# EAGLE design Solar Charge Controller  (EAGLE 7.7.0)
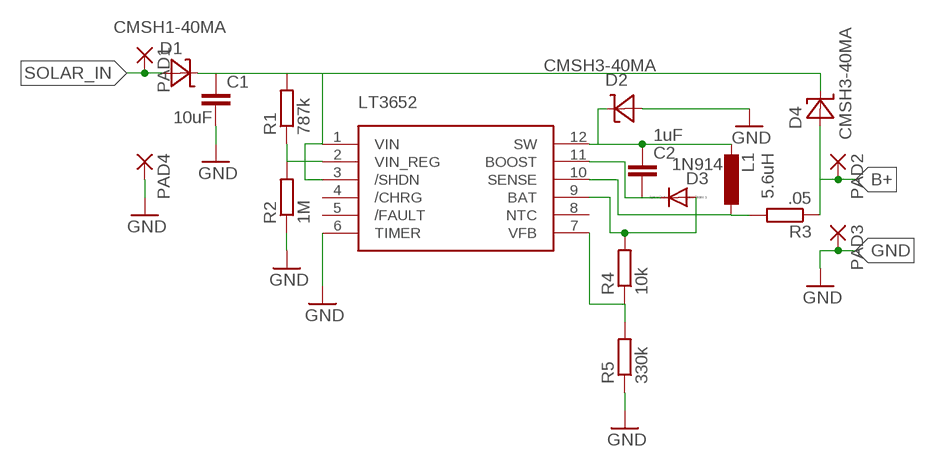
[diagram p0: schematic, sheet 1]

## Parts
C1  10uF  C-EUC0805  [C0805]
C2  1uF  C-EUC0603  [C0603]
D1  CMSH1-40MA  [DO-214AC]
D2  CMSH3-40MA  [DO-214AC]
D3  1N914  [SOD523]
D4  CMSH3-40MA  [DO-214AC]
L1  5.6uH  L-EU1008  [1008(2510METRIC)]
PAD1  SMD5  [SMD2,54-5,08]
PAD2  SMD5  [SMD2,54-5,08]
PAD3  SMD5  [SMD2,54-5,08]
PAD4  SMD5  [SMD2,54-5,08]
R1  787k  R-EU_R0603  [R0603]
R2  1M  R-EU_R0603  [R0603]
R3  .05  R-EU_R0805  [R0805]
R4  10k  R-EU_R0603  [R0603]
R5  330k  R-EU_R0603  [R0603]
U$1  LT3652  [MSOP12]

## Nets
B+: D4.A PAD2.1(P) R3.1
GND: C1.2 D2.A PAD3.1(P) PAD4.1(P) R2.1 R5.1 U$1.6(TIMER)
N$1: C1.1 D1.C D4.C R1.2 U$1.1(VIN) U$1.3(/SHDN)
N$2: R1.1 R2.2 U$1.2(VIN_REG)
N$3: C2.1 D2.C L1.P$3 U$1.12(SW)
N$4: L1.P$2 R3.2 U$1.10(SENSE)
N$5: D3.A R4.2 U$1.9(BAT)
N$6: C2.2 D3.C U$1.11(BOOST)
N$7: R4.1 R5.2 U$1.7(VFB)
SOLAR_IN: D1.A PAD1.1(P)
Unconnected: U$1.4(/CHRG) U$1.5(/FAULT) U$1.8(NTC)

## Library data of the parts
C1 C2 = rcl:C-EU: CAPACITOR, European symbol
D1 = diode:CMSH1-40MA
D2 D4 = diode:CMSH3-40MA
D3 = diode:1N914
L1 = rcl:L-EU: INDUCTOR, European symbol
PAD1-PAD4 = wirepad:SMD5: SMD PAD
R1 R2 R4 R5 = rcl:R-EU_: RESISTOR, European symbol
R3 = resistor:R-EU_: RESISTOR, European symbol
U$1 = linear-technology:LT3652

## Board
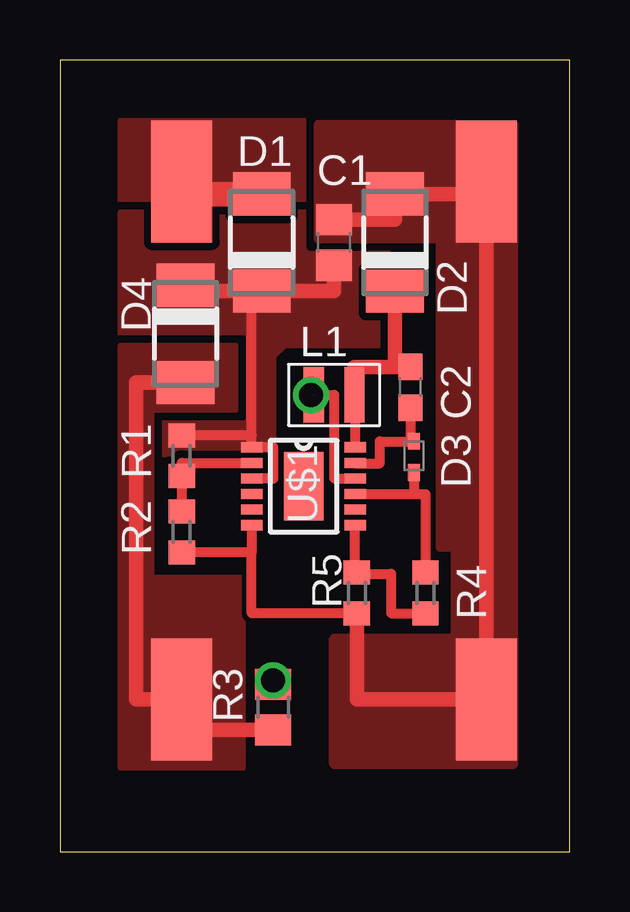
[diagram p1: board, top side]
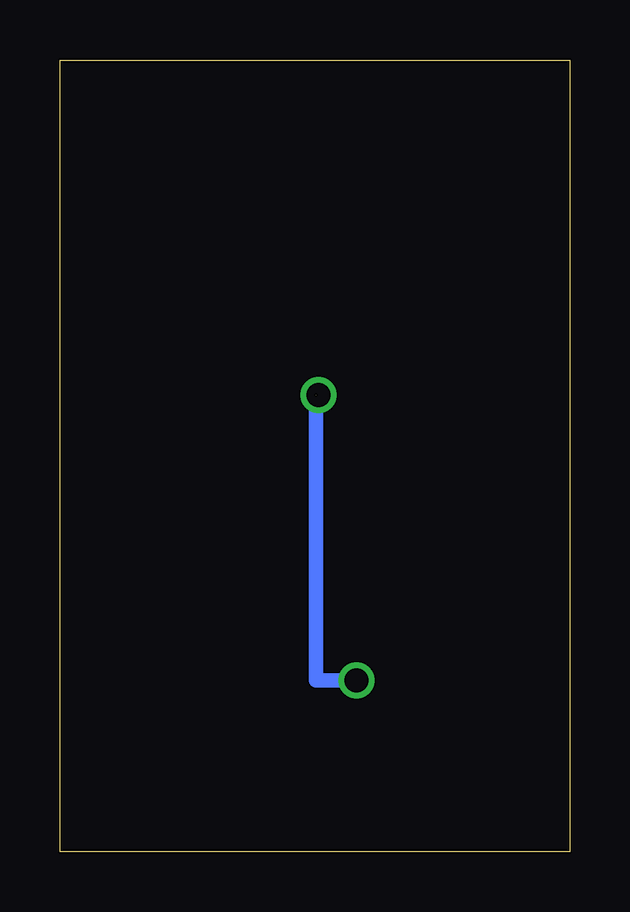
[diagram p2: board, bottom side, seen from below]

Size 21.26 x 33.01 mm. Coordinates in mm from the lower left corner, seen from the top.
Outline: 0,0 21.26,0 21.26,33.01 0,33.01 0,0
Copper layers (1*16): Top 0.035mm / dielectric 1.5mm / Bottom 0.035mm
Design rules "default": minimum track width 10mil, minimum drill 24mil, track to track 8mil, track to pad 8mil, pad to pad 8mil, via to via 8mil, smd to smd 8mil, copper to edge 40mil, drill to drill 8mil, minimum pad ring 10mil, minimum via ring 8mil, stop-mask expansion 4mil, vias tented up to drill 0mil, thermal gap 10mil

### Footprints (pad centres in the part's own frame; a part is rotated, then mirrored left to right if it is on the bottom)
C0805 = smd 1.3 x 1.5: 1 -0.95,0; 2 0.95,0
C0603 = smd 1.1 x 1: 1 -0.85,0; 2 0.85,0
DO-214AC = smd 1.8 x 2.4: A 2.025,0; C -2.025,0
SOD523 = smd 0.7 x 0.5: A 0.7,0; C -0.6,0
1008(2510METRIC) = smd 0.85 x 2.3: P$2 -0.85,0; P$3 0.85,0
SMD2,54-5,08 = smd 2.54 x 5.08: 1 0,0
R0603 = smd 1 x 1.1: 1 -0.85,0; 2 0.85,0
R0805 = smd 1.3 x 1.5: 1 -0.95,0; 2 0.95,0
MSOP12 = smd 0.9 x 0.42: 1 -2.163,1.625; 2 -2.163,0.975; 3 -2.163,0.325; 4 -2.163,-0.325; 5 -2.163,-0.975; 6 -2.163,-1.625; 7 2.15,-1.625; 8 2.15,-0.975; 9 2.15,-0.325; 10 2.15,0.325; 11 2.15,0.975; 12 2.15,1.625 | smd 1.65 x 2.85: EXP 0,0

### Placement (x,y rotation side)
C1  11.43,25.4 90 top
C2  14.61,19.37 270 top
D1  8.41,25.4 90 top
D2  13.97,25.4 90 top
D3  14.76,16.51 270 top
D4  5.24,21.59 270 top
L1  11.43,19.05 0 top
PAD1  5.08,27.94 0 top
PAD2  5.08,6.35 0 top
PAD3  17.78,6.35 0 top
PAD4  17.78,27.94 0 top
R1  5.08,16.51 90 top
R2  5.08,13.34 90 top
R3  8.89,6.03 90 top
R4  15.24,10.79 90 top
R5  12.38,10.79 90 top
U$1  10.16,15.24 0 top

### Tracks (layer width: path | path; a pad name or v marks a point on that pad's centre or on a via)
B+
  Top 0.61: PAD2.1 3.17,6.35 3.17,19.57 D4.A | PAD2.1 | R3.1 5.08,5.08 PAD2.1
  pour Top (no thermals): 2.54,21.11 7.3,21.11 7.3,18.41 3.81,18.41 3.81,11.43 7.62,11.43 7.62,3.49 2.54,3.49
GND
  Top 0.406: U$1.6 8,12.48 | 8,12.48 R2.1 | R5.1 8,9.95 8,12.48
  Top 0.61: C1.2 13.97,26.35 D2.A 17.78,27.43 | 17.78,27.43 PAD4.1 | 17.78,27.43 PAD3.1 12.38,6.35 R5.1
  pour Top (no thermals): 11.43,8.89 16.51,8.89 16.51,12.7 15.88,12.7 15.88,25.56 10.79,25.56 10.79,30.32 18.89,30.32 18.89,3.65 11.43,3.65
N$1
  Top 0.406: 8,17.36 U$1.1 8.89,16.86 8.89,15.56 U$1.3 | 8,17.36 R1.2 | 8,17.36 8,23.38 7.62,23.38
  Top 0.61: C1.1 11.43,23.38 D1.C 7.62,23.38 5.24,23.38 D4.C
  pour Top (isolate 0.318, rank 2, no thermals): 2.54,26.67 13.65,26.67 13.65,21.11 9.37,21.11 8.89,20.64 8.89,16.51 2.54,16.51
N$2
  Top 0.406: R2.2 R1.1 5.08,16.21 U$1.2
N$3
  Top 0.406: L1.P$3 12.31,17.78 U$1.12
  Top 0.61: D2.C 13.97,20.22 | 13.97,20.22 C2.1 | L1.P$3 12.28,20.22 13.97,20.22
N$4  (via drill 1)  (1 unrouted)
  Top 0.406: L1.P$2 11.43,19.05 11.43,15.56 U$1.10
  Top 0.61: R3.2 v8.89,7.14
  Bottom 0.61: v8.89,7.14 10.58,7.14 L1.P$2
N$5
  Top 0.406: R4.2 15.24,14.91 14.76,14.91 | U$1.9 14.76,14.91 | D3.A 14.76,14.91
N$6
  Top 0.406: U$1.11 12.31,16.19 13.34,16.19 13.34,17.11 D3.C 14.61,17.11 C2.2
N$7
  Top 0.406: U$1.7 12.31,11.64 R5.2 12.44,11.59 13.81,11.59 13.81,9.95 R4.1
N$8  (via drill 1)
  other vias: 10.48,19.05
SOLAR_IN
  Top 1.016: PAD1.1 5.08,27.43 D1.A
  pour Top (isolate 0.318, rank 3, no thermals): 2.54,30.48 10.16,30.48 10.16,26.67 2.54,26.67